# Altium project Large_Connector_Interface.PrjPcb
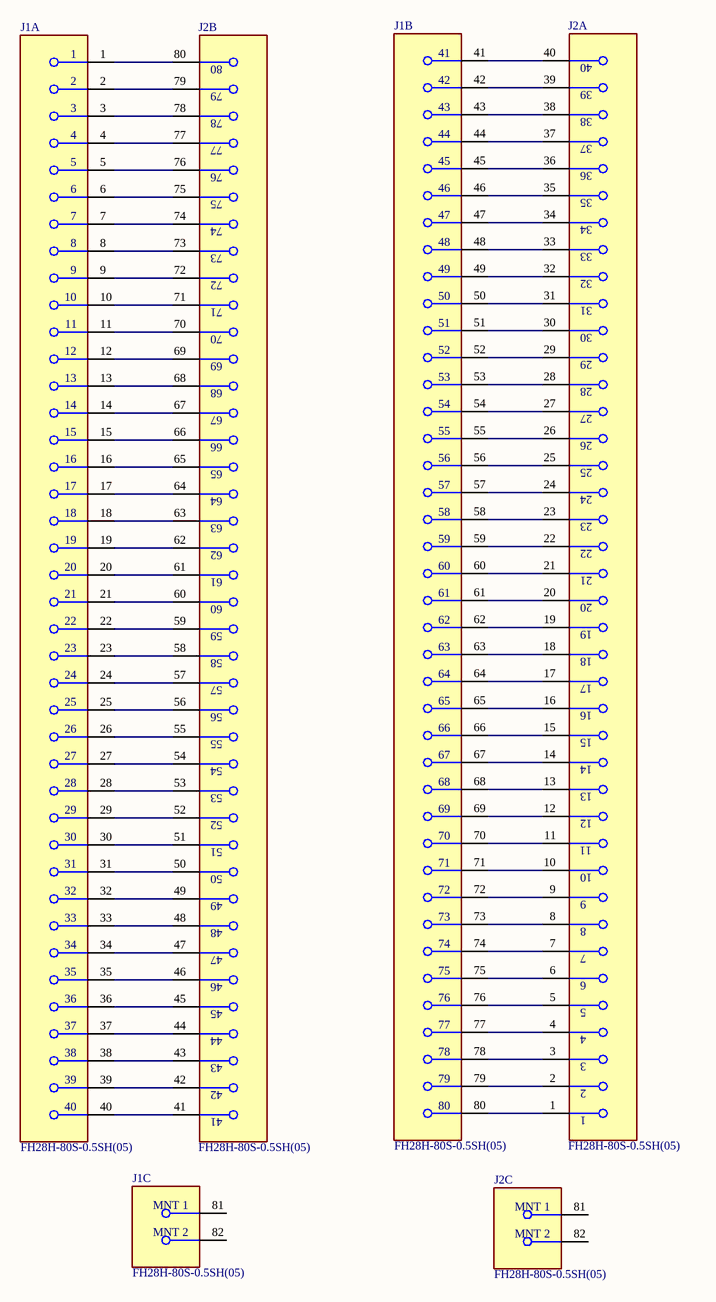
[diagram p0: Sheet1.SchDoc]
CAGE_CODE: ?????; CONTRACT_NUMBER: <CONTRACT NO>; DOC_NO_ASSY_DWG: <ASSY DWG NO>; DOC_NO_BOM: <BOM DOC NO>; DOC_NO_FAB_DWG: <FAB DWG NO>; DOC_NO_SCH_DWG: <SCH DWG NO>; PCB_2_DEC_TOL: +/-.01; PCB_3_DEC_TOL: +/-.010; PCB_ANG_TOL: +/-1/2; PCB_ASSEMBLY_NO: <PCB ASSY NO>; PCB_CHECKER: - -----; PCB_CHECKER_APP_DATE: --/--/----; PCB_DESIGNER: - -----; PCB_DESIGNER_APP_DATE: --/--/----; PCB_DWG_NO: <PCB DWG NO>; PCB_ENGINEER: - -----; PCB_ENGINEER_APP_DATE: --/--/----; PCB_PART_NUMBER: <PCB PN>; PCB_REV: A; SCH_REV: A
1 sheet, 2 parts. Net scope: global (net labels, ports and power ports of the same name join across sheets).
Board file: PCB1.PcbDoc

## Sheet Sheet1.SchDoc
size 431 x 279 mm; SheetNumber: 1; SheetTotal: 1; ENG_APP_DATE: --/--/--; DSN_APP_DATE: --/--/--; CHK_APP_DATE: --/--/--

### Parts
J1  FH28H-80S-0.5SH(05)  [FP-FH28H-80S-0_5SH_05-MFG]  (parts A,B,C of 3)
J2  FH28H-80S-0.5SH(05)  [FP-FH28H-80S-0_5SH_05-MFG]  (parts A,B,C of 3)

### Nets
NetJ1_1: J1.1 J2.80
NetJ1_2: J1.2 J2.79
NetJ1_3: J1.3 J2.78
NetJ1_4: J1.4 J2.77
NetJ1_5: J1.5 J2.76
NetJ1_6: J1.6 J2.75
NetJ1_7: J1.7 J2.74
NetJ1_8: J1.8 J2.73
NetJ1_9: J1.9 J2.72
NetJ1_10: J1.10 J2.71
NetJ1_11: J1.11 J2.70
NetJ1_12: J1.12 J2.69
NetJ1_13: J1.13 J2.68
NetJ1_14: J1.14 J2.67
NetJ1_15: J1.15 J2.66
NetJ1_16: J1.16 J2.65
NetJ1_17: J1.17 J2.64
NetJ1_18: J1.18 J2.63
NetJ1_19: J1.19 J2.62
NetJ1_20: J1.20 J2.61
NetJ1_21: J1.21 J2.60
NetJ1_22: J1.22 J2.59
NetJ1_23: J1.23 J2.58
NetJ1_24: J1.24 J2.57
NetJ1_25: J1.25 J2.56
NetJ1_26: J1.26 J2.55
NetJ1_27: J1.27 J2.54
NetJ1_28: J1.28 J2.53
NetJ1_29: J1.29 J2.52
NetJ1_30: J1.30 J2.51
NetJ1_31: J1.31 J2.50
NetJ1_32: J1.32 J2.49
NetJ1_33: J1.33 J2.48
NetJ1_34: J1.34 J2.47
NetJ1_35: J1.35 J2.46
NetJ1_36: J1.36 J2.45
NetJ1_37: J1.37 J2.44
NetJ1_38: J1.38 J2.43
NetJ1_39: J1.39 J2.42
NetJ1_40: J1.40 J2.41
NetJ1_41: J1.41 J2.40
NetJ1_42: J1.42 J2.39
NetJ1_43: J1.43 J2.38
NetJ1_44: J1.44 J2.37
NetJ1_45: J1.45 J2.36
NetJ1_46: J1.46 J2.35
NetJ1_47: J1.47 J2.34
NetJ1_48: J1.48 J2.33
NetJ1_49: J1.49 J2.32
NetJ1_50: J1.50 J2.31
NetJ1_51: J1.51 J2.30
NetJ1_52: J1.52 J2.29
NetJ1_53: J1.53 J2.28
NetJ1_54: J1.54 J2.27
NetJ1_55: J1.55 J2.26
NetJ1_56: J1.56 J2.25
NetJ1_57: J1.57 J2.24
NetJ1_58: J1.58 J2.23
NetJ1_59: J1.59 J2.22
NetJ1_60: J1.60 J2.21
NetJ1_61: J1.61 J2.20
NetJ1_62: J1.62 J2.19
NetJ1_63: J1.63 J2.18
NetJ1_64: J1.64 J2.17
NetJ1_65: J1.65 J2.16
NetJ1_66: J1.66 J2.15
NetJ1_67: J1.67 J2.14
NetJ1_68: J1.68 J2.13
NetJ1_69: J1.69 J2.12
NetJ1_70: J1.70 J2.11
NetJ1_71: J1.71 J2.10
NetJ1_72: J1.72 J2.9
NetJ1_73: J1.73 J2.8
NetJ1_74: J1.74 J2.7
NetJ1_75: J1.75 J2.6
NetJ1_76: J1.76 J2.5
NetJ1_77: J1.77 J2.4
NetJ1_78: J1.78 J2.3
NetJ1_79: J1.79 J2.2
NetJ1_80: J1.80 J2.1

Not connected (* = marked no-connect by the designer): J1 81(MNT_1) 82(MNT_2); J2 81(MNT_1) 82(MNT_2)

### Notes on the sheet
- 8
- 7
- 6
- 5
- 4
- 3
- DWG. NO.
- REV.
- SHT.
- 2
- 1
- THIS DOCUMENT AND THE DATA DISCLOSED HEREIN OR HEREWITH IS THE PROPERTY OF ALTIUM LIMITED AND MAY BE FREELY DISTRIBUTED IN WHOLE. NO RIGHTS ARE RESERVED OR EXPRESS OR IMPLIED WARANTEE GIVEN.
- REVISION
- DESCRIPTION
- DATE
- APPROVED
- F
- E
- D
- C
- B
- ENG:
- APPROVALS
- PROJECT
- SUITE 200
- 2175 SALK AVENUE
- CARLSBAD, CA 92008
- A
- DSN:
- CHK:
- REFERENCE DOCUMENTS
- PROJECT REVISION:
- TITLE
- DOCUMENT REVISION:
- DESIGN ITEM:
- USA
- BOM:
- FAB DWG:
- PCB DWG:
- ASSY DWG:
- SCALE:
- SIZE
- CAGE CODE
- FILE NAME
- DWG NO.
- SHEET
- OF
- REV

### Library data of the parts
J1 J2 = CMP-11609-000031-1: CONN FFC BOTTOM 80POS 0.50MM R/A; Number of Positions: 80; Voltage Rating: 50V; Contact Resistance: 50mR; Max Current Rating: 500mA; Gender: Receptacle; Pitch: 0.5mm; Mating Cycles: 20; Actuator Material: Polymer; Insulation Resistance: 500MR; System: Connector; Contact Plating: Gold; Orientation: Right Angle; Contact Material: Bronze; Number of Rows: 1; Max Operating Temperature: 85°C; Number of Contacts: 80; Flammability Rating: UL94 V-0; Lead Pitch: 0.5mm; Length: 44.9mm; Radiation Hardening: No; Packaging: Tape and Reel; RoHS Compliant: Yes; REACH SVHC: No SVHC; Current Rating: 500mA; Housing Color: Grey; Depth: 6.5mm; Min Operating Temperature: -40°C; Series: FH28; Termination: Solder; Package Quantity: 1; Housing Material: Polymer; Mount: Surface Mount; Max Voltage Rating (AC): 50V